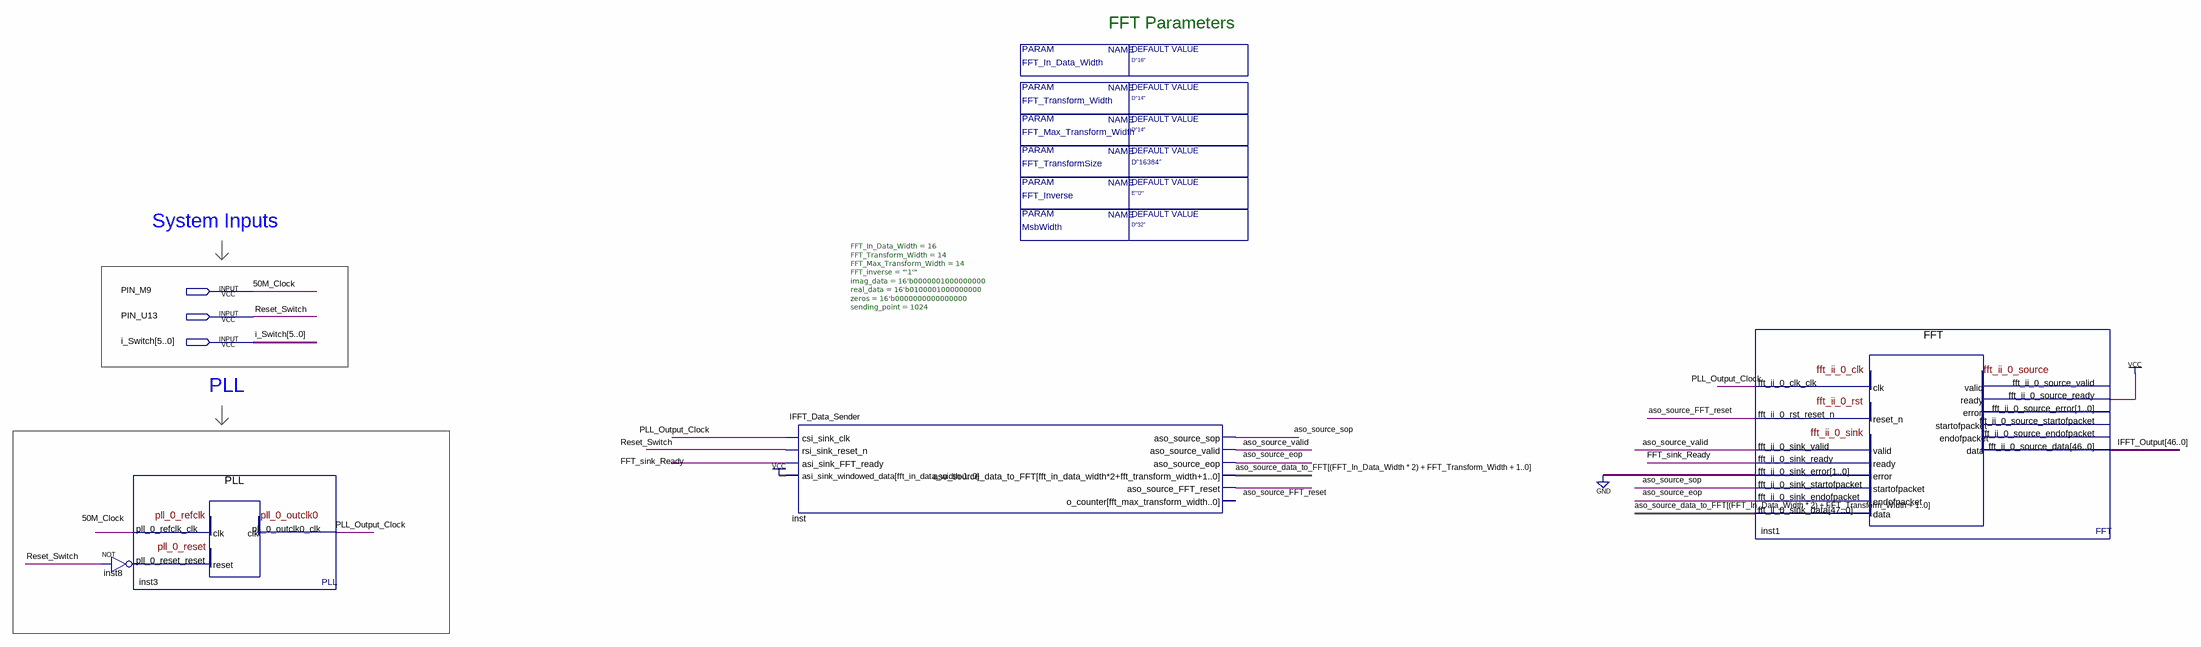
[diagram p0: schematic sheet]
// Quartus schematic IFFT_Try.bdf as structural Verilog: 4 symbols, 3 pins
module IFFT_Try #(parameter FFT_Inverse = "E\"'0'\"", parameter FFT_In_Data_Width = "D\"16\"", parameter FFT_Transform_Width = "D\"14\"", parameter FFT_Max_Transform_Width = "D\"14\"", parameter FFT_TransformSize = "D\"16384\"", parameter MsbWidth = "D\"32\"") (
  input  PIN_M9,
  input  PIN_U13,
  input  [5:0] i_Switch
);

  wire \aso_source_data_to_FFT[(FFT_In_Data_Width_*_2)_+_FFT_Transform_Width_+_1..0] , aso_source_eop,
       aso_source_FFT_reset, aso_source_sop, aso_source_valid, FFT_sink_Ready, inst8_out, PLL_Output_Clock;
  wire [46:0] IFFT_Output;

  PLL inst3 (.pll_0_refclk_clk(PIN_M9), .pll_0_reset_reset(inst8_out), .pll_0_outclk0_clk(PLL_Output_Clock));
  not inst8 (inst8_out, PIN_U13);
  IFFT_Data_Sender #(.FFT_In_Data_Width(16), .FFT_Transform_Width(14), .FFT_Max_Transform_Width(14), .FFT_inverse("'1'"), .imag_data(16'b0000001000000000), .real_data(16'b0100001000000000), .zeros(16'b0000000000000000), .sending_point(1024)) inst (
    .csi_sink_clk(PLL_Output_Clock), .rsi_sink_reset_n(PIN_U13), .asi_sink_FFT_ready(FFT_sink_Ready),
    .asi_sink_windowed_data({16{1'b1}}), .aso_source_sop(aso_source_sop),
    .aso_source_valid(aso_source_valid), .aso_source_eop(aso_source_eop),
    .aso_source_data_to_FFT(\aso_source_data_to_FFT[(FFT_In_Data_Width_*_2)_+_FFT_Transform_Width_+_1..0] ),
    .aso_source_FFT_reset(aso_source_FFT_reset));  // open: o_counter
  FFT inst1 (
    .fft_ii_0_clk_clk(PLL_Output_Clock), .fft_ii_0_rst_reset_n(aso_source_FFT_reset),
    .fft_ii_0_sink_valid(aso_source_valid), .fft_ii_0_sink_error(2'b00),
    .fft_ii_0_sink_startofpacket(aso_source_sop), .fft_ii_0_sink_endofpacket(aso_source_eop),
    .fft_ii_0_sink_data({48{\aso_source_data_to_FFT[(FFT_In_Data_Width_*_2)_+_FFT_Transform_Width_+_1..0] }}),
    .fft_ii_0_source_ready(1'b1), .fft_ii_0_sink_ready(FFT_sink_Ready), .fft_ii_0_source_data(IFFT_Output));  // open: fft_ii_0_source_valid, fft_ii_0_source_error, fft_ii_0_source_startofpacket, fft_ii_0_source_endofpacket

  // Other names for the same wires on the sheet: 50M_Clock = PIN_M9; Reset_Switch = PIN_U13

  // Notes on the sheet:
  //   FFT Parameters
  //   System Inputs   
  //   PLL
endmodule
